# Altium schematic sheet RFM232_V02.SchDoc
size 420 x 297 mm; Scale: {Масш.}; Title1str: {Наименование}; PageSetup: Record=PageOptions|CenterHorizontal=False|CenterVertical=False|PrintScale=0.95|XCorrection=0.00|YCorrection=0.00|PrintKind=1|BorderSize=5000000|LeftOffset=0|BottomOffset=0|Orientation=1|PaperLength=1000|PaperWidth=1000|Scale=100|PaperSource=15|PrintQuality=600|MediaType=1|DitherType=10|PaperKind=A4|PrintScaleMode=1; Title2str: {Наименование}; ProcessInspection: {Т.контр.}; Mass: {Масса}; NormInspection: {Н.контр.}; EngineerName: {Инженер}; Letter1Column: {}; Letter2Column: {}; Letter3Column: {}; DocumentType: {Документ}; DocumentType1str: {Документ}; DocumentType2str: {Документ}
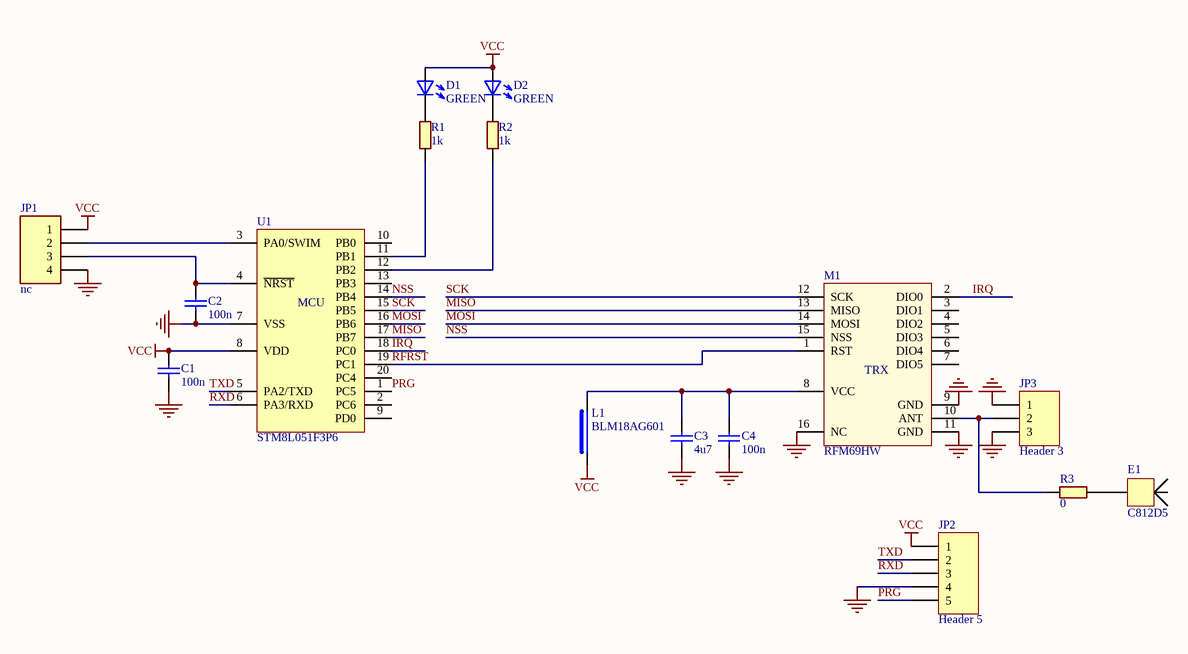
[diagram p0: RFM232_V02.SchDoc]

## Parts
C1  100n  [CAPC1608X08N]
C2  100n  [CAPC1608X08N]
C3  4u7  [CAPC2012X11N]
C4  100n  [CAPC1608X08N]
D1  GREEN  [LEDC200X125X80L40N]
D2  GREEN  [LEDC200X125X80L40N]
E1  C812D5  [C812D5]
JP1  nc  [HDRV4W70P254_4X1_889X254H754]
JP2  Header 5  [HDRV5W70P254_5X1_1143X254H754]
JP3  Header 3  [HDRV3W70P254_3X1_635X254H754]
L1  BLM18AG601  [INDC1608X10N]
M1  RFM69HW  [LGA16_RFM69]
R1  1k  [RESC1608X06N]
R2  1k  [RESC1608X06N]
R3  0  [RESC2012X07N]
U1  STM8L051F3P6  [TSOP65P640X110-20N]

## Nets
GND: C1.2 C2.2 C3.2 C4.2 JP1.4 JP2.4 JP3.1 JP3.3 M1.9(GND) M1.11(GND) M1.16(NC) U1.7(VSS)
VCC: C1.1 D1.A D2.A JP1.1 JP2.1 L1.1 U1.8(VDD)
IRQ: M1.2(DIO0) U1.18(PC0)
MISO: M1.13(MISO) U1.17(PB7)
MOSI: M1.14(MOSI) U1.16(PB6)
NSS: M1.15(NSS) U1.14(PB4)
PRG: JP2.5 U1.1(PC5)
RFRST: M1.1(RST) U1.19(PC1)
RXD: JP2.3 U1.6(PA3/RXD)
SCK: M1.12(SCK) U1.15(PB5)
TXD: JP2.2 U1.5(PA2/TXD)
NetC2_1: C2.1 JP1.3 U1.4(~{NRST})
NetC3_1: C3.1 C4.1 L1.2 M1.8(VCC)
NetD1_K: D1.K R1.1
NetD2_K: D2.K R2.1
NetE1_1: E1.1(IN) R3.2
NetJP1_2: JP1.2 U1.3(PA0/SWIM)
NetJP3_2: JP3.2 M1.10(ANT) R3.1
NetR1_2: R1.2 U1.11(PB1)
NetR2_2: R2.2 U1.12(PB2)

Not connected (* = marked no-connect by the designer): M1 3(DIO1) 4(DIO2) 5(DIO3) 6(DIO4) 7(DIO5); U1 2(PC6) 9(PD0) 10(PB0) 13(PB3) 20(PC4)

## Notes on the sheet
- Перв. примен.
- Справ. №
- Подп. и дата
- Инв. № дубл.
- Взам. инв. №
- Изм.
- Лист
- № докум.
- Подп.
- Дата
- Лит.
- Масса
- Масштаб
- Т.контр.
- Пров.
- Разраб.
- Листов
- Инв. № подл.
- Н.контр.
- Утв.
- Копировал
- Формат А3
- (in symbol RFM69HW_V13_2) TRX
- (in symbol STM8L051F3P6) MCU

## Library data of the parts
C1-C4 = CAPN
D1 D2 = DLED
JP1 = HEADER 4: 4 Pin Header 2,0 mm, 1x04; Part Field 1: CviLux
JP2 = Header 5: Header, 5-Pin; LatestRevisionDate: 17-Jul-2002; LatestRevisionNote: Re-released for DXP Platform.; Publisher: Altium Limited
JP3 = Header 3: Header, 3-Pin; LatestRevisionDate: 17-Jul-2002; LatestRevisionNote: Re-released for DXP Platform.; Publisher: Altium Limited
L1 = SUPRESOR: Примечание: *; Производитель: *
M1 = RFM69HW_V13_2
R1-R3 = RES